# EAGLE design Rectifi-Presicion-Doble (EAGLE 7.2.0)
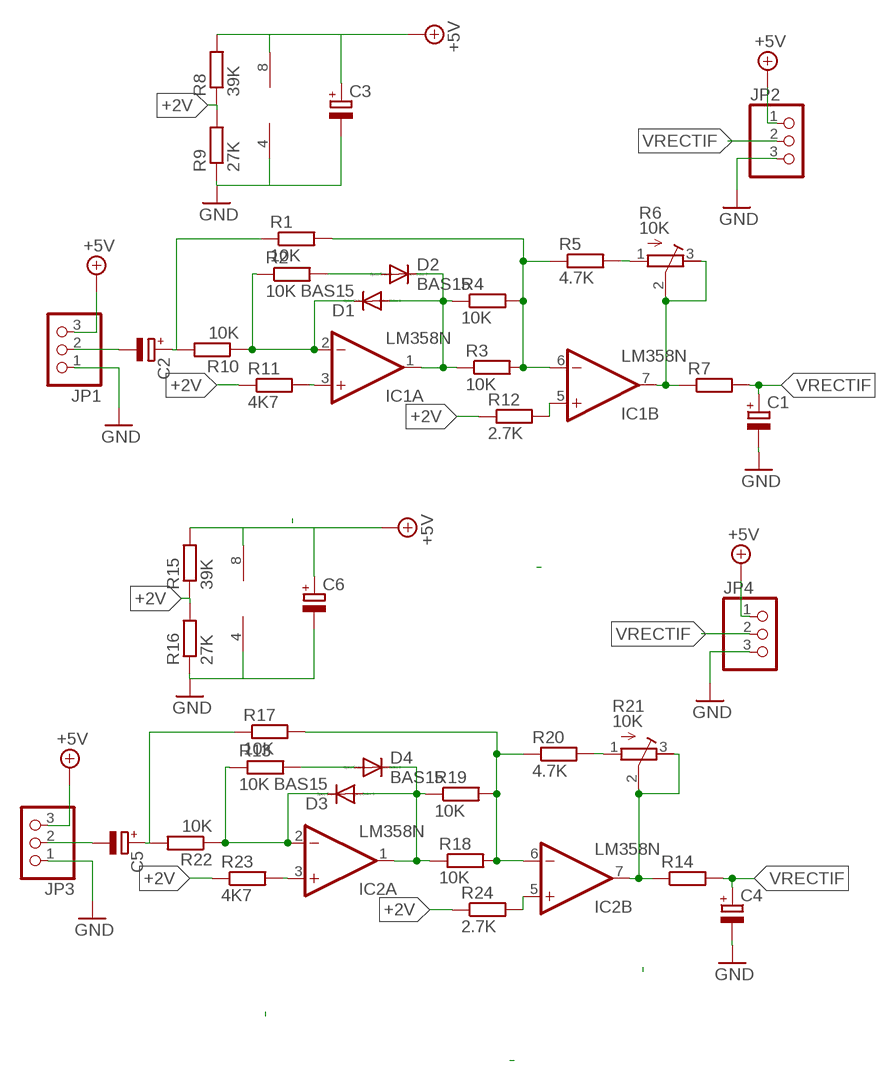
[diagram p0: schematic, sheet 1]

## Parts
C1  CPOL-EUE2.5-5  [E2,5-5]
C2  CPOL-EUE2.5-5  [E2,5-5]
C3  CPOL-EUE2.5-6  [E2,5-6]
C4  CPOL-EUE2.5-5  [E2,5-5]
C5  CPOL-EUE2.5-5  [E2,5-5]
C6  CPOL-EUE2.5-6  [E2,5-6]
D1  BAS15  [DO34-7]
D2  BAS15  [DO34-7]
D3  BAS15  [DO34-7]
D4  BAS15  [DO34-7]
IC1  LM358N  [DIL08]
IC2  LM358N  [DIL08]
JP1  PINHD-1X3  [1X03]
JP2  PINHD-1X3  [1X03]
JP3  PINHD-1X3  [1X03]
JP4  PINHD-1X3  [1X03]
R1  10K  R-EU_0207/7  [0207/7]
R2  10K  R-EU_0207/7  [0207/7]
R3  10K  R-EU_0207/7  [0207/7]
R4  10K  R-EU_0207/7  [0207/7]
R5  4.7K  R-EU_0207/7  [0207/7]
R6  10K  R-TRIMM64W  [RTRIM64W]
R7  R-EU_0207/7  [0207/7]
R8  39K  R-EU_0207/7  [0207/7]
R9  27K  R-EU_0207/7  [0207/7]
R10  10K  R-EU_0207/7  [0207/7]
R11  4K7  R-EU_0207/7  [0207/7]
R12  2.7K  R-EU_0207/7  [0207/7]
R13  10K  R-EU_0207/7  [0207/7]
R14  R-EU_0207/7  [0207/7]
R15  39K  R-EU_0207/7  [0207/7]
R16  27K  R-EU_0207/7  [0207/7]
R17  10K  R-EU_0207/7  [0207/7]
R18  10K  R-EU_0207/7  [0207/7]
R19  10K  R-EU_0207/7  [0207/7]
R20  4.7K  R-EU_0207/7  [0207/7]
R21  10K  R-TRIMM64W  [RTRIM64W]
R22  10K  R-EU_0207/7  [0207/7]
R23  4K7  R-EU_0207/7  [0207/7]
R24  2.7K  R-EU_0207/7  [0207/7]

## Nets
+2V: R8.1 R9.2 R11.1 R12.1 R15.1 R16.2 R23.1 R24.1
+5V: C3.+ C6.+ IC1.8(P:V+) IC2.8(P:V+) JP1.3 JP2.1 JP3.3 JP4.1 R8.2 R15.2
GND: C1.- C3.- C4.- C6.- IC1.4(P:V-) IC2.4(P:V-) JP1.1 JP2.3 JP3.1 JP4.3 R9.1 R16.1
N$1: D1.A D2.C IC1.1(A:OUT) R3.1 R4.1
N$2: C2.+ R1.1 R10.2
N$3: R5.2 R6.1(A)
N$4: D2.A R2.2
N$5: D3.A D4.C IC2.1(A:OUT) R18.1 R19.1
N$6: IC1.6(B:-IN) R1.2 R3.2 R4.2 R5.1
N$7: D1.C IC1.2(A:-IN) R2.1 R10.1
N$8: IC1.7(B:OUT) R6.2(S) R6.3(E) R7.1
N$10: C2.- JP1.2
N$11: IC2.7(B:OUT) R14.1 R21.2(S) R21.3(E)
N$14: C5.- JP3.2
N$15: IC1.5(B:+IN) R12.2
N$18: R20.2 R21.1(A)
N$19: IC2.6(B:-IN) R17.2 R18.2 R19.2 R20.1
N$20: D3.C IC2.2(A:-IN) R13.1 R22.1
N$21: C5.+ R17.1 R22.2
N$22: D4.A R13.2
N$23: IC2.5(B:+IN) R24.2
VPOL: IC1.3(A:+IN) R11.2
VPOL1: IC2.3(A:+IN) R23.2
VRECTIF: C1.+ C4.+ JP2.2 JP4.2 R7.2 R14.2

## Library data of the parts
C1-C6 = rcl:CPOL-EU: POLARIZED CAPACITOR, European symbol
D1-D4 = diode:BAS15: DIODE high speed
IC1 IC2 = linear:LM358: OP AMP also LM158; LM258; LM2904 Source: http://cache.national.com/ds/LM/LM158.pdf
JP1-JP4 = pinhead:PINHD-1X3: PIN HEADER
R1-R5 R7-R20 R22-R24 = resistor:R-EU_: RESISTOR, European symbol
R6 R21 = resistor:R-TRIMM: Trimm resistor

## Board
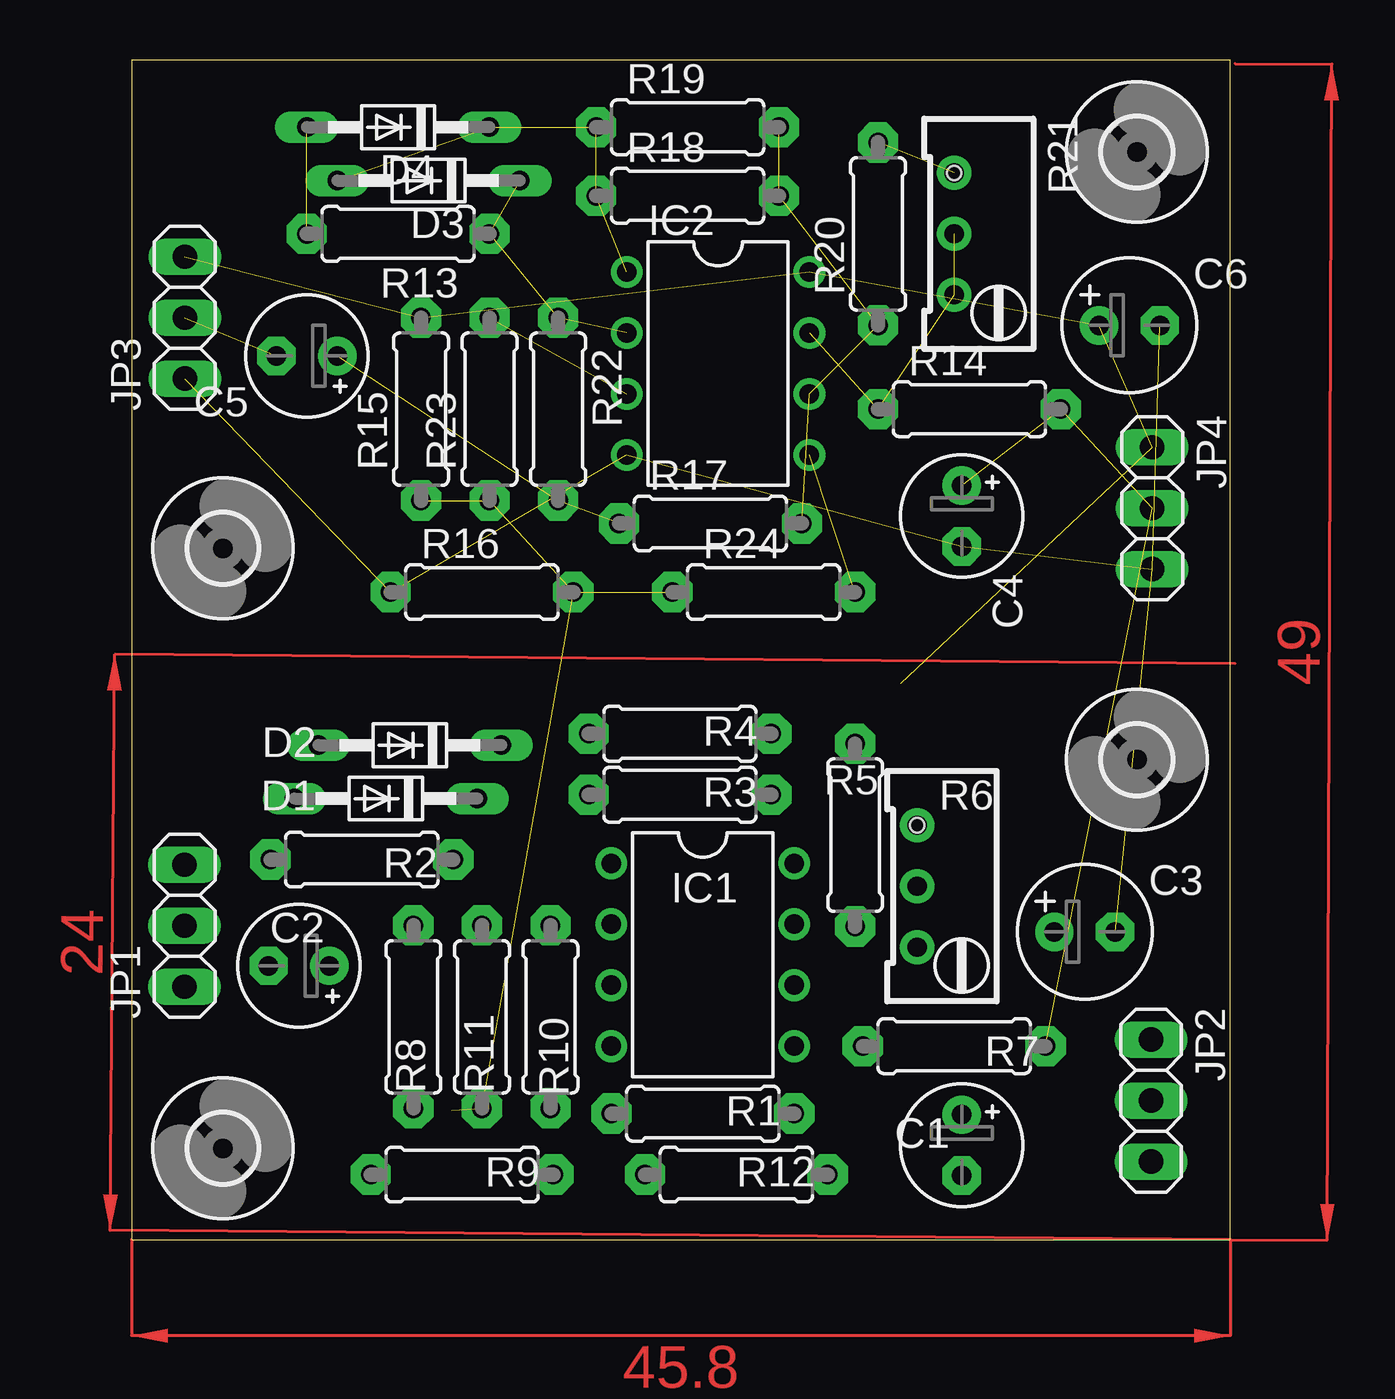
[diagram p1: board, top side]
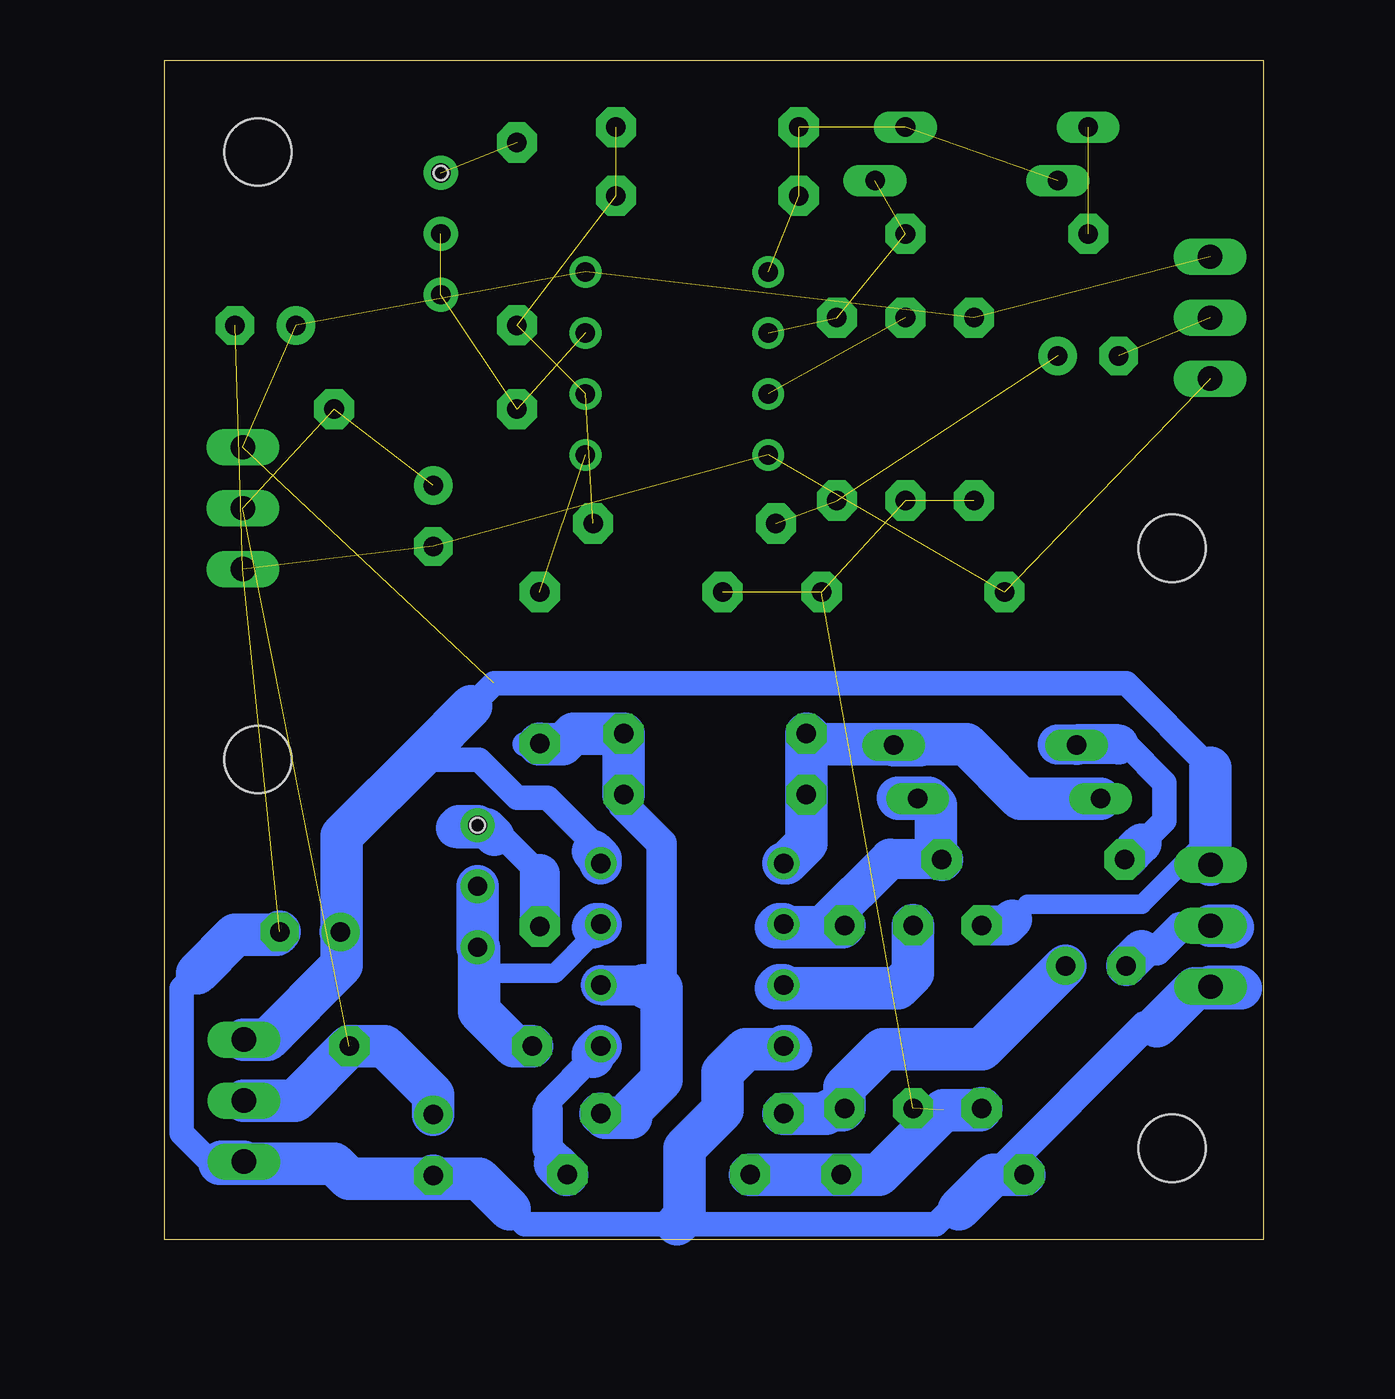
[diagram p2: board, bottom side, seen from below]

Size 45.8 x 49.16 mm. Coordinates in mm from the lower left corner, seen from the top.
Outline: 0,0 45.8,0 45.8,49.16 0,49.16 0,0
Copper layers (1*16): Top 0.035mm / dielectric 1.5mm / Bottom 0.035mm
Design rules "default": minimum track width 10mil, minimum drill 24mil, track to track 8mil, track to pad 8mil, pad to pad 8mil, via to via 8mil, smd to smd 8mil, copper to edge 40mil, drill to drill 8mil, minimum pad ring 10mil, minimum via ring 8mil, stop-mask expansion 4mil, vias tented up to drill 0mil, thermal gap 10mil

### Footprints (pad centres in the part's own frame; a part is rotated, then mirrored left to right if it is on the bottom)
E2,5-5 = drill 0.813 pad 1.6: + -1.27,0 | drill 0.813 pad 1.6 octagon: - 1.27,0
E2,5-6 = drill 0.813 pad 1.6: + -1.27,0 | drill 0.813 pad 1.6 octagon: - 1.27,0
DO34-7 = drill 0.813 long: A 3.81,0; C -3.81,0
DIL08 = drill 0.813 pad 1.27: 1 -3.81,-3.81; 2 -1.27,-3.81; 3 1.27,-3.81; 4 3.81,-3.81; 5 3.81,3.81; 6 1.27,3.81; 7 -1.27,3.81; 8 -3.81,3.81
1X03 = drill 1.016 long: 1 -2.54,0; 2 0,0; 3 2.54,0
0207/7 = drill 0.813 pad 1.676 octagon: 1 -3.81,0; 2 3.81,0
RTRIM64W = drill 0.8 pad 1.422: 1 1.27,-2.54; 2 1.27,0; 3 1.27,2.54 | hole 0.6: 1.27,-2.54
2,8 = hole 2.8: 0,0

### Placement (x,y rotation side)
C1  34.61,3.94 270 top
C2  6.99,11.41 180 top
C3  39.73,12.83 0 top
C4  34.61,30.16 270 top
C5  7.3,36.83 180 top
C6  41.59,38.1 0 top
D1  10.6,18.38 180 top
D2  11.6,20.61 180 top
D3  12.38,44.13 180 top
D4  11.11,46.35 180 top
IC1  23.81,11.88 270 top
IC2  24.45,36.51 270 top
JP1  2.21,13.08 90 top
JP2  42.5,5.79 270 top
JP3  2.22,38.42 90 top
JP4  42.55,30.48 270 top
R1  23.81,5.25 0 top
R2  9.6,15.84 180 top
R3  22.86,18.54 0 top
R4  22.86,21.08 0 top
R5  30.16,16.86 270 top
R6  34.02,14.73 180 top
R7  34.29,8.06 0 top
R8  11.75,9.29 90 top
R9  13.78,2.71 0 top
R10  17.46,9.29 270 top
R11  14.61,9.29 90 top
R12  25.21,2.71 0 top
R13  11.11,41.91 180 top
R14  34.92,34.61 0 top
R15  12.06,34.61 90 top
R16  14.61,26.99 0 top
R17  24.13,29.84 0 top
R18  23.18,43.5 0 top
R19  23.18,46.35 0 top
R20  31.11,41.91 90 top
R21  35.56,41.91 180 top
R22  17.78,34.61 270 top
R23  14.92,34.61 90 top
R24  26.35,26.99 0 top
U$1  [2,8]  3.81,3.81 0 top
U$2  [2,8]  41.91,20 0 top
U$3  [2,8]  3.81,28.81 0 top
U$4  [2,8]  41.91,45.32 0 top

### Tracks (layer width: path | path; a pad name or v marks a point on that pad's centre or on a via)
+2V  (5 unrouted)
  Bottom 1.778: R12.1 R9.2 16.02,2.71 13.34,5.4 11.83,5.4 R8.1
+5V  (5 unrouted)
  Bottom 0.813: 10.48,13.34 9.84,13.97 5.07,13.97 2.21,16.83
  Bottom 1.016: 33.02,22.23 32.07,23.18 5.71,23.18 2.21,19.67 | 27.94,16.19 27.94,16.51 29.84,18.41 31.11,18.41 32.7,20 34.61,20 34.92,20.32
  Bottom 1.676: R8.2 10.71,13.1 10.48,13.34
  Bottom 1.778: JP1.3 2.21,16.83 2.21,19.67 | 33.02,22.23 34.92,20.32 38.42,16.83 38.42,12.88 | 38.42,12.88 C3.+ | JP2.1 41.51,8.34 38.42,11.43 38.42,12.88 | IC1.8 27.62,15.88 27.94,16.19
GND  (6 unrouted)
  Bottom 1.016: 12.7,1.27 13.02,1.27 13.65,0.64 24.45,0.64 30.8,0.64 31.43,1.27 | JP2.3 43.9,3.25 45.09,4.45 45.09,10.48 44.45,11.11
  Bottom 1.27: 4.45,8.89 4.94,8.89 11.11,2.71
  Bottom 1.778: R9.1 11.11,2.71 11.26,2.71 12.7,1.27 | 31.43,1.27 32.7,2.54 34.48,2.54 C1.- 34.73,2.54 38.1,2.54 38.73,3.17 43.5,3.17 43.42,3.25 JP2.3 | JP1.1 1.02,10.54 0.95,10.48 2.86,10.48 4.45,8.89 | IC1.4 19.81,8.06 19.68,7.94 21.59,7.94 22.54,6.99 22.54,5.4 24.13,3.81 24.13,0.95 24.45,0.64 | 44.45,11.11 42.86,12.7 41.13,12.7 C3.-
N$1
  Bottom 1.778: IC1.1 19.88,15.69 19.05,16.51 19.05,17.14 R3.1 R4.1 18.61,20.64 14.29,20.64 | D2.C 14.32,20.61 14.29,20.64 | D1.A 10.13,18.38 12.38,20.64 14.29,20.64
N$2
  Bottom 1.778: R1.1 18.24,5.25 18.1,5.4 17.54,5.4 R10.2 17.46,6.35 15.88,7.94 11.73,7.94 C2.+
N$3
  Bottom 1.016: 32.07,16.83 31.75,16.83 30.16,15.24
  Bottom 1.676: R6.1 33.53,17.27 33.66,17.14 32.38,17.14 32.07,16.83 | 30.16,15.24 R5.2
N$4
  Bottom 1.016: 5.08,16.51 4.13,17.46 4.13,19.05 5.71,20.64 6.03,20.64
  Bottom 1.676: R2.2 5.75,15.84 5.08,16.51 | 6.03,20.64 7.82,20.64 | 8.57,20.64 7.82,20.64 | 7.82,20.64 D2.A
N$5  (4 unrouted)
N$6
  Bottom 1.016: 30.8,20.64 30.16,20.64
  Bottom 1.27: R3.2 26.67,18.1 25.08,16.51 25.08,9.21
  Bottom 1.676: IC1.6 25.84,10.61
  Bottom 1.778: 25.84,10.61 25.72,10.48 25.08,10.48 25.08,9.21 25.08,6.67 26.35,5.4 26.35,5.08 27.45,5.08 R1.2 | R5.1 30.2,20.64 30.16,20.64 29.21,20.64 28.77,21.08 R4.2 R3.2
N$7
  Bottom 1.676: R10.1 18.34,13.1 | 18.34,13.1 18.41,13.02 | 18.34,13.1 15.56,15.88 13.44,15.88 R2.1
  Bottom 1.778: IC1.2 20.19,13.14 20.32,13.02 18.41,13.02 17.54,13.02 R10.1 | D1.C 15.21,18.38 15.24,18.41 13.97,18.41 13.65,18.1 13.65,16.09 R2.1
N$8
  Bottom 0.813: 27.94,13.02 27.94,12.7 29.53,11.11 32.7,11.11
  Bottom 1.778: R7.1 31.24,8.06 32.7,9.53 32.7,11.11 32.7,12.14 R6.3 R6.2 | IC1.7 27.81,13.14 27.94,13.02
N$10
  Bottom 1.27: 5.08,12.06 4.45,12.06 3.49,13.02 2.27,13.02 JP1.2
  Bottom 1.676: C2.- 5.71,11.43 5.08,12.06
  Bottom 1.778: JP1.2 1.33,13.08 1.27,13.02
N$11  (3 unrouted)
N$14  (1 unrouted)
N$15
  Bottom 1.016: 29.84,5.4 29.84,5.71 27.94,7.62
  Bottom 1.27: 29.53,3.17 29.53,3.49 29.84,3.81 29.84,5.4
  Bottom 1.778: R12.2 29.07,2.71 29.53,3.17 | 27.94,7.62 27.94,7.75 IC1.5
N$18  (1 unrouted)
N$19  (4 unrouted)
N$20  (3 unrouted)
N$21  (2 unrouted)
N$22  (1 unrouted)
N$23  (1 unrouted)
VPOL
  Bottom 1.778: IC1.3 20.19,10.61 20.32,10.48 15.24,10.48 14.61,11.11 R11.2
VPOL1  (1 unrouted)
VRECTIF  (3 unrouted)
  Bottom 1.778: C1.+ 34.61,6.03 36.64,8.06 R7.2 40.37,5.79 JP2.2
(copper drawn outside any net)
  shapes: Top area x3